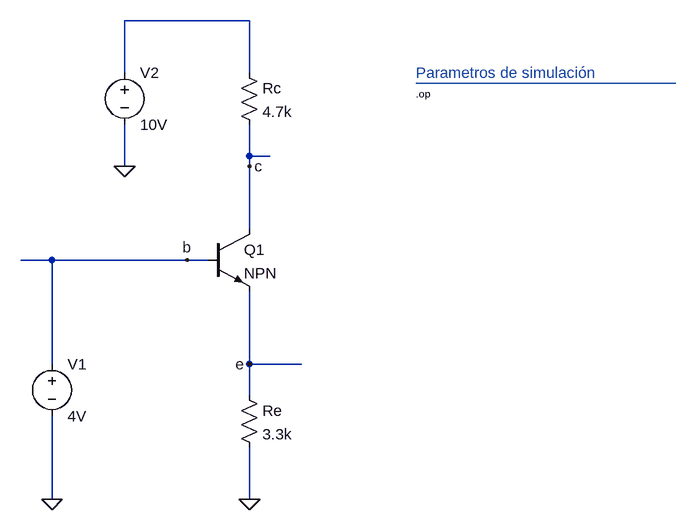
[diagram p0: schematic ejemplo_5-4.asc]
ejemplo_5-4.asc, the LTspice schematic file:
Version 4
SHEET 1 1376 680
WIRE -32 -320 -224 -320
WIRE -224 -240 -224 -320
WIRE -32 -240 -32 -320
WIRE -32 -112 -32 -160
WIRE 0 -112 -32 -112
WIRE -224 -96 -224 -160
WIRE -32 -96 -32 -112
WIRE -32 0 -32 -96
WIRE -336 48 -384 48
WIRE -128 48 -336 48
WIRE -96 48 -128 48
WIRE -336 208 -336 48
WIRE -32 208 -32 96
WIRE 48 208 -32 208
WIRE -32 256 -32 208
WIRE -336 416 -336 288
WIRE -32 416 -32 336
FLAG -32 416 0
FLAG -336 416 0
FLAG -224 -96 0
FLAG -32 -96 c
FLAG -32 208 e
FLAG -128 48 b
DATAFLAG -384 48 ""
DATAFLAG 48 208 ""
DATAFLAG 0 -112 ""
DATAFLAG -192 80 "Ib(Q1)"
DATAFLAG 64 144 "I(Re)"
DATAFLAG 64 -16 "Ic(Q1)"
SYMBOL res -48 -256 R0
SYMATTR InstName Rc
SYMATTR Value 4.7k
SYMBOL npn -96 0 R0
SYMATTR InstName Q1
SYMBOL res -48 240 R0
SYMATTR InstName Re
SYMATTR Value 3.3k
SYMBOL voltage -336 192 R0
WINDOW 123 0 0 Left 0
WINDOW 39 0 0 Left 0
SYMATTR InstName V1
SYMATTR Value 4V
SYMBOL voltage -224 -256 R0
WINDOW 123 0 0 Left 0
WINDOW 39 0 0 Left 0
SYMATTR InstName V2
SYMATTR Value 10V
TEXT 224 -240 Left 2 ;Parametros de simulación
TEXT 224 -208 Left 1 !.op
LINE Normal 624 -224 224 -224
LINE Normal 624 -224 624 -224 2
LINE Normal 624 -224 624 -224 2

The netlist it stands for:
* ejemplo_5-4.asc
Rc N001 c 4.7k
Q1 c b e 0 NPN
Re e 0 3.3k
V1 b 0 4V
V2 N001 0 10V
.model NPN NPN
.model PNP PNP
.lib standard.bjt
* Parametros de simulación
.op
.backanno
.end